# EAGLE schematic untitled_AS_AVT (EAGLE 6.3)
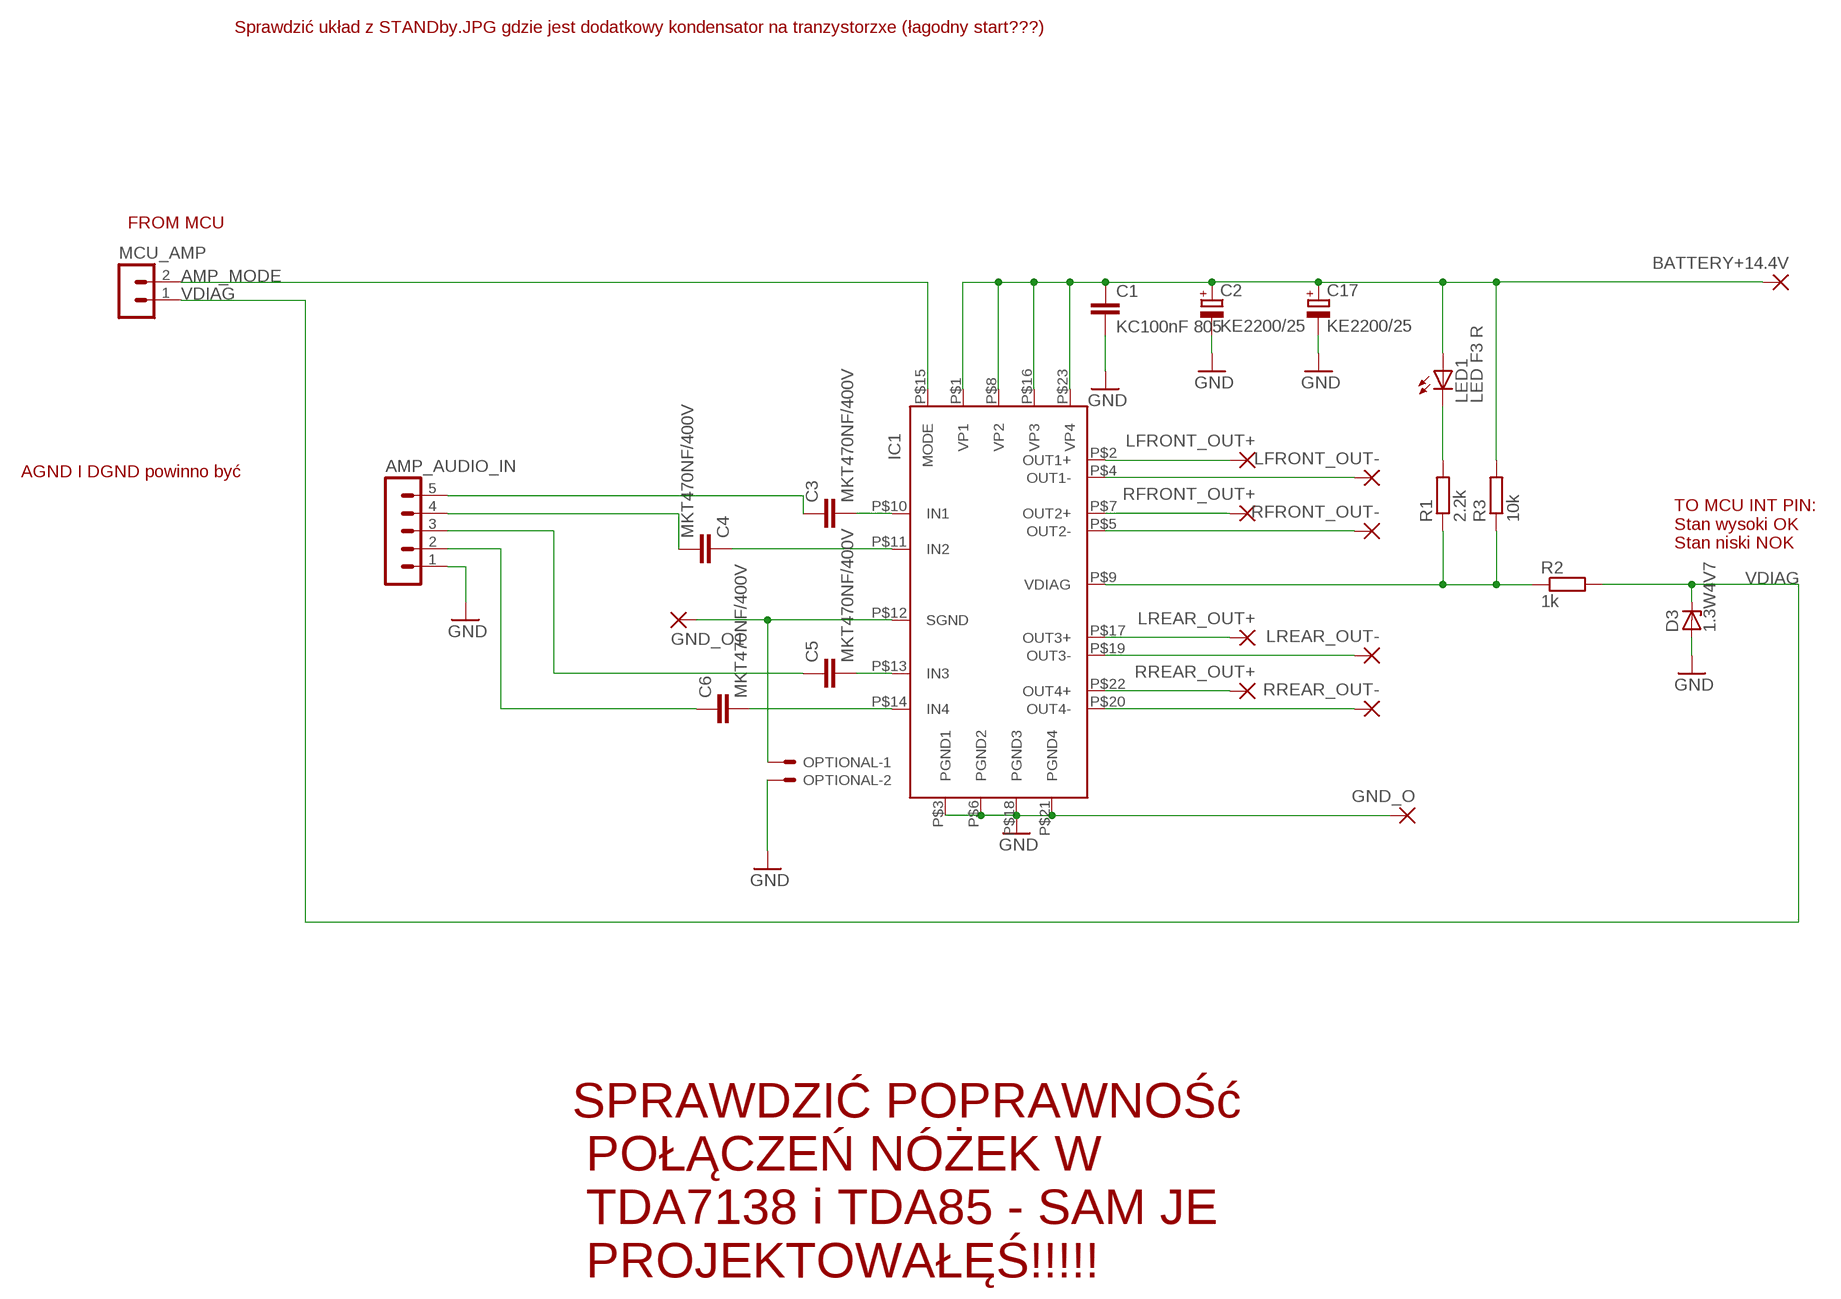
[diagram p0: schematic, sheet 1]

## Parts
AMP_AUDIO_IN  MA05-1  [MA05-1]
BATTERY+14.4V  WIREPAD2,54/1,0  [2,54/1,0]
C1  KC100nF 805  C-EUC0805  [C0805]
C2  KE2200/25  CPOL-EUE10-20  [EB20D]
C3  MKT470NF/400V  C-EU025-024X044  [C025-024X044]
C4  MKT470NF/400V  C-EU025-024X044  [C025-024X044]
C5  MKT470NF/400V  C-EU025-024X044  [C025-024X044]
C6  MKT470NF/400V  C-EU025-024X044  [C025-024X044]
C17  KE2200/25  CPOL-EUE10-20  [EB20D]
D3  1.3W4V7  ZENER-DIODEZD-5  [ZDIO-5]
GND_O  WIREPAD2,54/1,0  [2,54/1,0]
GND_O1  WIREPAD2,54/1,0  [2,54/1,0]
IC1  TDA8571J  [SOT411-1]
LED1  LED F3 R  LED3MM  [LED3MM]
LFRONT_OUT+  WIREPAD2,54/1,0  [2,54/1,0]
LFRONT_OUT-  WIREPAD2,54/1,0  [2,54/1,0]
LREAR_OUT+  WIREPAD2,54/1,0  [2,54/1,0]
LREAR_OUT-  WIREPAD2,54/1,0  [2,54/1,0]
MCU_AMP  MA02-1  [MA02-1]
OPTIONAL  332-02  [332-02]
R1  2.2k  R-EU_0204/5  [0204/5]
R2  1k  R-EU_0204/5  [0204/5]
R3  10k  R-EU_0204/5  [0204/5]
RFRONT_OUT+  WIREPAD2,54/1,0  [2,54/1,0]
RFRONT_OUT-  WIREPAD2,54/1,0  [2,54/1,0]
RREAR_OUT+  WIREPAD2,54/1,0  [2,54/1,0]
RREAR_OUT-  WIREPAD2,54/1,0  [2,54/1,0]

## Nets
+14.4V: BATTERY+14.4V.1(P) C1.1 C2.+ C17.+ IC1.P$1(VP1) IC1.P$8(VP2) IC1.P$16(VP3) IC1.P$23(VP4) LED1.A R3.2
AMP_MODE: IC1.P$15(MODE) MCU_AMP.2
GND: AMP_AUDIO_IN.1 C1.2 C2.- C17.- D3.A GND_O.1(P) IC1.P$3(PGND1) IC1.P$6(PGND2) IC1.P$18(PGND3) IC1.P$21(PGND4) OPTIONAL.2
N$2: IC1.P$2(OUT1+) LFRONT_OUT+.1(P)
N$3: IC1.P$4(OUT1-) LFRONT_OUT-.1(P)
N$4: IC1.P$7(OUT2+) RFRONT_OUT+.1(P)
N$5: IC1.P$5(OUT2-) RFRONT_OUT-.1(P)
N$6: IC1.P$17(OUT3+) LREAR_OUT+.1(P)
N$7: IC1.P$19(OUT3-) LREAR_OUT-.1(P)
N$8: IC1.P$22(OUT4+) RREAR_OUT+.1(P)
N$9: IC1.P$20(OUT4-) RREAR_OUT-.1(P)
N$10: C3.2 IC1.P$10(IN1)
N$11: C4.1 IC1.P$11(IN2)
N$12: C5.2 IC1.P$13(IN3)
N$13: C6.2 IC1.P$14(IN4)
N$14: AMP_AUDIO_IN.5 C3.1
N$16: AMP_AUDIO_IN.4 C4.2
N$18: IC1.P$9(VDIAG) R1.1 R2.1 R3.1
N$19: LED1.K(C) R1.2
N$38: GND_O1.1(P) IC1.P$12(SGND) OPTIONAL.1
N$44: AMP_AUDIO_IN.3 C5.1
N$45: AMP_AUDIO_IN.2 C6.1
VDIAG: D3.C MCU_AMP.1 R2.2

## Notes on the sheet
- Sprawdzić układ z STANDby.JPG gdzie jest dodatkowy kondensator na tranzystorzxe (łagodny start???)
- FROM MCU
- AGND I DGND powinno być
- TO MCU INT PIN:
  Stan wysoki OK
  Stan niski NOK
- SPRAWDZIĆ POPRAWNOŚć
   POŁĄCZEŃ NÓŻEK W
   TDA7138 i TDA85 - SAM JE
   PROJEKTOWAŁĘŚ!!!!!

## Library data of the parts
AMP_AUDIO_IN = con-lstb:MA05-1: PIN HEADER; OC_FARNELL: unknown; OC_NEWARK: unknown
BATTERY+14.4V GND_O GND_O1 LFRONT_OUT+ LFRONT_OUT- LREAR_OUT+ LREAR_OUT- RFRONT_OUT+ RFRONT_OUT- RREAR_OUT+ RREAR_OUT- = wirepad:WIREPAD: Wire PAD connect wire on PCB
C1 C3-C6 = rcl:C-EU: CAPACITOR, European symbol
C2 C17 = rcl:CPOL-EU: POLARIZED CAPACITOR, European symbol
D3 = diode:ZENER-DIODE: Z-Diode
IC1 = Audio-Power-amplifier:TDA8571J: 2x40W Stereo BTL Amplifier
LED1 = led:LED: LED OSRAM: - CHIPLED LG R971, LG N971, LY N971, LG Q971, LY Q971, LO R971, LY R971 LH N974, LH R974 LS Q976, LO Q976, LY Q976 LO Q996 - Hyper CHIPLED LW Q18S LB Q993, LB Q99A, LB R99A - SideLED LS A670, LO A670, LY A670, LG A670, LP A670 LB A673, LV A673, LT A673, LW A673 LH A674 LY A675 LS A676, LA A676, LO A676, LY A676, LW A676 LS A679, LY A679, LG A679 - Hyper Micro SIDELED® LS Y876, LA Y876, LO Y876, LY Y876 LT Y87S - SmartLED LW L88C, LW L88S LB L89C, LB L89S, LG L890 LS L89K, LO L89K, LY L89K LS L896, LA L896, LO L896, LY L896 - TOPLED LS T670, LO T670, LY T670, LG T670, LP T670 LSG T670, LSP T670, LSY T670, LOP T670, LYG T670 LG T671, LOG T671, LSG T671 LB T673, LV T673, LT T673, LW T673 LH T674 LS T676, LA T676, LO T676, LY T676, LB T676, LH T676, LSB T676, LW T676 LB T67C, LV T67C, LT T67C, LS T67K, LO T67K, LY T67K, LW E67C LS E67B, LA E67B, LO E67B, LY E67B, LB E67C, LV E67C, LT E67C LW T67C LS T679, LY T679, LG T679 LS T770, LO T770, LY T770, LG T770, LP T770 LB T773, LV T773, LT T773, LW T773 LH T774 LS E675, LA E675, LY E675, LS T675 LS T776, LA T776, LO T776, LY T776, LB T776 LHGB T686 LT T68C, LB T68C - Hyper Mini TOPLED® LB M676 - Mini TOPLED Santana® LG M470 LS M47K, LO M47K, LY M47K Source: http://www.osram.convergy.de LUXEON: - LUMILED® LXK2-PW12-R00, LXK2-PW12-S00, LXK2-PW14-U00, LXK2-PW14-V00 LXK2-PM12-R00, LXK2-PM12-S00, LXK2-PM14-U00 LXK2-PE12-Q00, LXK2-PE12-R00, LXK2-PE12-S00, LXK2-PE14-T00, LXK2-PE14-U00 LXK2-PB12-K00, LXK2-PB12-L00, LXK2-PB12-M00, LXK2-PB14-N00, LXK2-PB14-P00, LXK2-PB14-Q00 LXK2-PR12-L00, LXK2-PR12-M00, LXK2-PR14-Q00, LXK2-PR14-R00 LXK2-PD12-Q00, LXK2-PD12-R00, LXK2-PD12-S00 LXK2-PH12-R00, LXK2-PH12-S00 LXK2-PL12-P00, LXK2-PL12-Q00, LXK2-PL12-R00 Source: www.luxeon.com KINGBRIGHT: KA-3528ASYC Source: www.kingbright.com
MCU_AMP = con-lstb_SileliS:MA02-1: PIN HEADER
OPTIONAL = con-garry:332-02: 2 Pin - 2mm Dual Row Source: www.mpe-connector.de / garry_shortform_2012.pdf
R1-R3 = rcl:R-EU_: RESISTOR, European symbol